# Altium project ATtiny85-DIP.PrjPCB
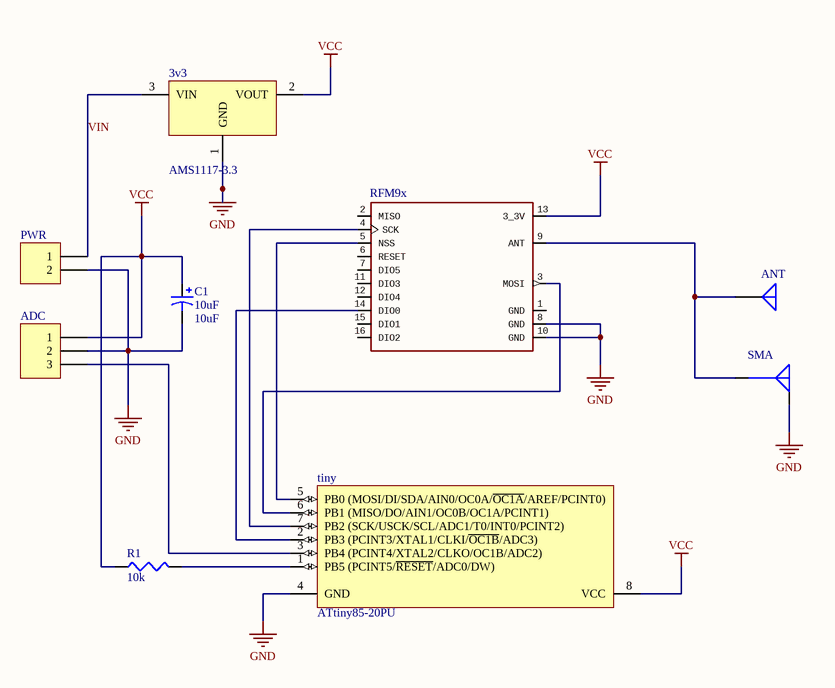
[diagram p0: rev1.SchDoc]
1 sheet, 9 parts. Net scope: global (net labels, ports and power ports of the same name join across sheets).
Board files: rev1_no3v3.PcbDoc, rev1_16mil.PcbDoc

## Sheet rev1.SchDoc
size A4

### Parts
3v3  AMS1117-3.3  [SOT-223]
ADC  (no value)  [HDR1X3]
ANT  (no value)  [PIN1]
C1  10uF  [C0805]
PWR  (no value)  [HDR1X2]
R1  10k  [C0805]
RFM9x  (no value)  [XCVR_RFM95W-868S2]
SMA  (no value)  [LINX CONREVSMA003.062]
tiny  ATtiny85-20PU  [8P3]

### Nets
GND: 3v3.1(GND) ADC.2 C1.2 PWR.2 RFM9x.8(GND) RFM9x.10(GND) SMA.G tiny.4(GND)
VCC: 3v3.2(VOUT) ADC.1 C1.1 R1.1 RFM9x.13(3_3V) tiny.8(VCC)
VIN: 3v3.3(VIN) PWR.1
NetADC_3: ADC.3 tiny.3(PB4_(PCINT4/XTAL2/CLKO/OC1B/ADC2))
NetANT_1: ANT.1(A) RFM9x.9(ANT) SMA.S
NetR1_2: R1.2 tiny.1(PB5_(PCINT5/~{RESET}/ADC0/DW))
NetRFM9x_3: RFM9x.3(MOSI) tiny.6(PB1_(MISO/DO/AIN1/OC0B/OC1A/PCINT1))
NetRFM9x_4: RFM9x.4(SCK) tiny.7(PB2_(SCK/USCK/SCL/ADC1/T0/INT0/PCINT2))
NetRFM9x_5: RFM9x.5(NSS) tiny.5(PB0_(MOSI/DI/SDA/AIN0/OC0A/~{OC1A}/AREF/PCINT0))
NetRFM9x_14: RFM9x.14(DIO0) tiny.2(PB3_(PCINT3/XTAL1/CLKI/~{OC1B}/ADC3))

Not connected (* = marked no-connect by the designer): RFM9x 1(GND) 2(MISO) 6(RESET) 7(DIO5) 11(DIO3) 12(DIO4) 15(DIO1) 16(DIO2)

### Library data of the parts
3v3 = AMS1117-3.3: 3.3V  3-Terminal Adjustable Positive Voltage Regulator
ADC = Header 3: Header, 3-Pin; LatestRevisionDate: 17-Jul-2002; LatestRevisionNote: Re-released for DXP Platform.; Publisher: Altium Limited
ANT = Antenna: Generic Antenna; Published: 24-Mar-1999; LatestRevisionDate: 17-Jul-2002; LatestRevisionNote: Re-released for DXP Platform.; PackageReference: PIN1; Publisher: Altium Limited
C1 = Cap Pol3: Polarized Capacitor (Surface Mount); Published: 8-Jun-2000; LatestRevisionDate: 29-May-2009; LatestRevisionNote: IPC-7351 Footprint Added.; PackageReference: C0805; Publisher: Altium Limited; PackageDescription: Chip Capacitor; Value: 10uF
PWR = Header 2: Header, 2-Pin; LatestRevisionDate: 17-Jul-2002; LatestRevisionNote: Re-released for DXP Platform.; Publisher: Altium Limited
R1 = Res3: Resistor; Published: 8-Jun-2000; LatestRevisionDate: 29-May-2009; LatestRevisionNote: IPC-7351 Footprint Added.; PackageReference: J1-0603; Publisher: Altium Limited; PackageDescription: Chip Resistor; Value: 10k
RFM9x = RFM95W-868S2: MF: RF; Package: SMD-16 Hope Microelectronics; Price: 7.72 USD; Availability: Unavailable; MP: RFM95W-868S2
SMA = RF Connector - SMA
tiny = ATtiny85-20PU: 8-bit AVR Microcontroller, 20MHz, 2.7-5.5V, 8K Flash, 512 Bytes EEPROM, 512 Bytes SRAM, Industrial Grade (-40ฐC to 85ฐC), 8-Lead PDIP, Pb-Free; DatasheetVersion: revN, Apr-2011; PackageVersion: revB, Jan-2002; PackageReference: 8P3; PackageDescription: 8-Lead, 0.300" Wide Body, Plastic Dual In-Line Package (PDIP); Code_JEDEC: MS-001-BA; ComponentLink1Description: Manufacturer URL; ComponentLink1URL: http://www.atmel.com/; ComponentLink2Description: ATtiny25/45/85 Datasheet; ComponentLink2URL: http://www.atmel.com/dyn/resources/prod_documents/doc2586.pdf; ComponentLink3Description: ATtiny25/45/85 Summary; ComponentLink3URL: http://www.atmel.com/dyn/resources/prod_documents/2586S.pdf